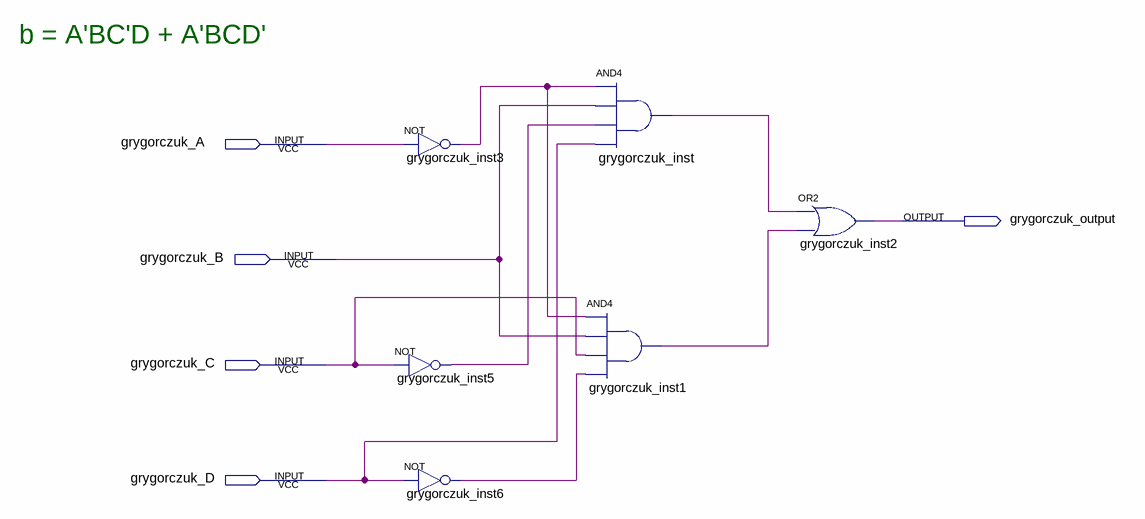
[diagram p0: schematic sheet]
// Quartus schematic SEVEN_SEGMENT_DISPLAY_NORMAL_B.bdf as structural Verilog: 6 symbols, 5 pins
module SEVEN_SEGMENT_DISPLAY_NORMAL_B (
  input  grygorczuk_A,
  input  grygorczuk_B,
  input  grygorczuk_C,
  input  grygorczuk_D,
  output grygorczuk_output
);

  wire grygorczuk_inst1_out, grygorczuk_inst3_out, grygorczuk_inst5_out, grygorczuk_inst6_out,
       grygorczuk_inst_out;

  not grygorczuk_inst3 (grygorczuk_inst3_out, grygorczuk_A);
  not grygorczuk_inst5 (grygorczuk_inst5_out, grygorczuk_C);
  not grygorczuk_inst6 (grygorczuk_inst6_out, grygorczuk_D);
  and grygorczuk_inst (grygorczuk_inst_out, grygorczuk_inst3_out, grygorczuk_B, grygorczuk_inst5_out, grygorczuk_D);
  and grygorczuk_inst1 (grygorczuk_inst1_out, grygorczuk_inst3_out, grygorczuk_B, grygorczuk_C, grygorczuk_inst6_out);
  or grygorczuk_inst2 (grygorczuk_output, grygorczuk_inst_out, grygorczuk_inst1_out);

  // Notes on the sheet:
  //   b = A'BC'D + A'BCD'
endmodule
